# EAGLE design PowerUART (EAGLE 9.0.0)
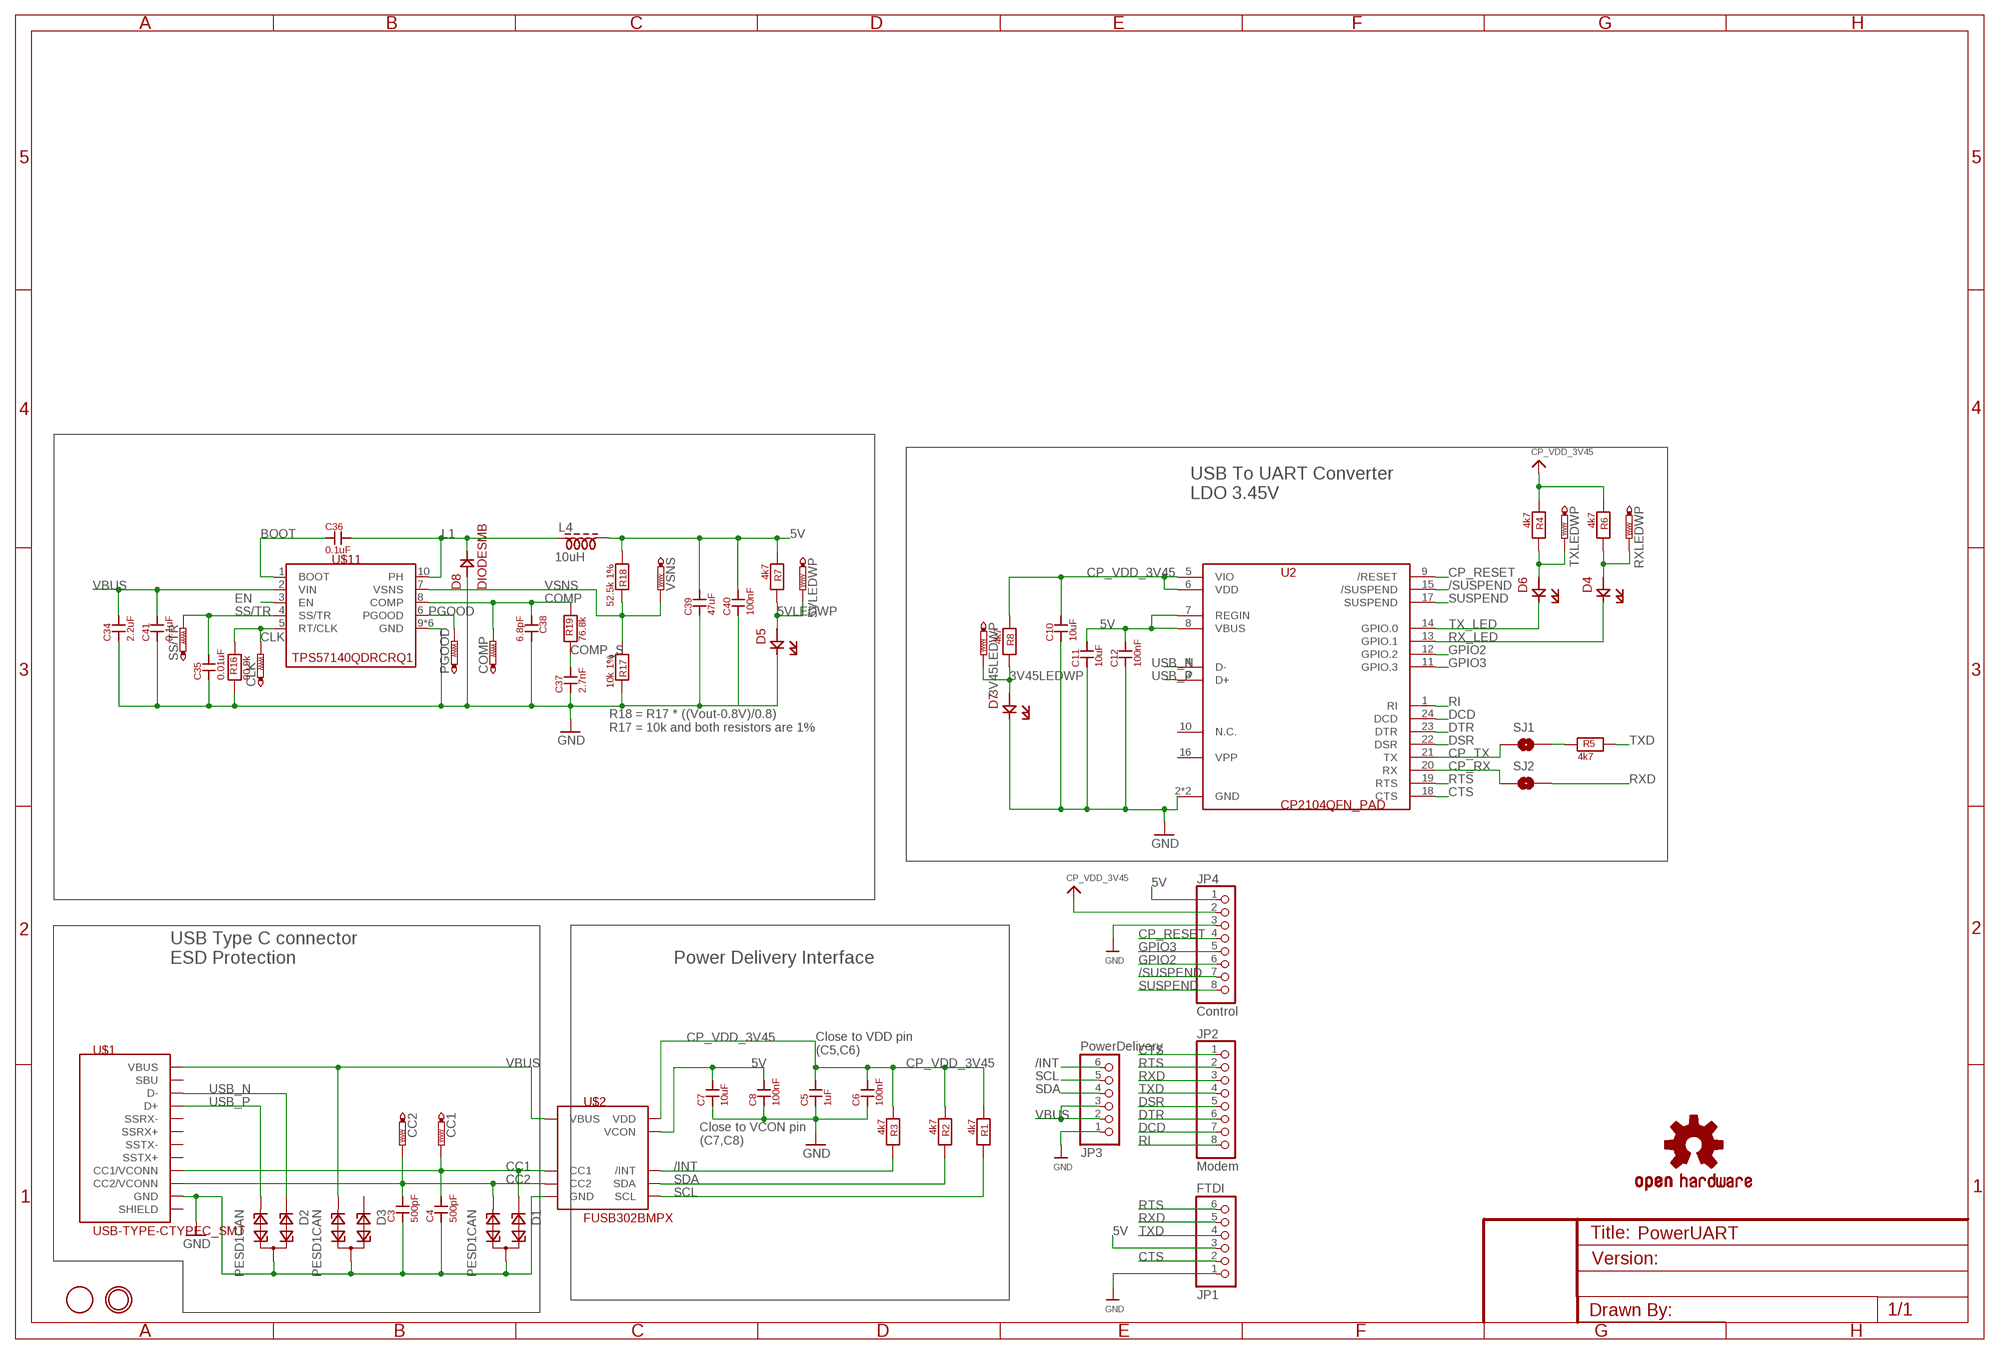
[diagram p0: schematic, sheet 1]

## Parts
3V45LEDWP  CP_RESET  PTR1B1,27  [B1,27]
5VLEDWP  CP_RESET  PTR1B1,27  [B1,27]
C3  500pF  C  [C0402K]
C4  500pF  C  [C0402K]
C5  1uF  C  [C0402K]
C6  100nF  C  [C0402K]
C7  10uF  C  [C0402K]
C8  100nF  C  [C0402K]
C10  10uF  C  [C0402K]
C11  10uF  C  [C0402K]
C12  100nF  C  [C0402K]
C34  2.2uF  C1206  [SM-1206]
C35  0.01uF  C  [C0402K]
C36  0.1uF  C  [C0402K]
C37  2.7nF  C  [C0402K]
C38  6.8pF  C  [C0402K]
C39  47uF  C1206  [SM-1206]
C40  100nF  C  [C0402K]
C41  0.1uF  C  [C0402K]
CC1  CP_RESET  PTR1B1,27  [B1,27]
CC2  CP_RESET  PTR1B1,27  [B1,27]
CLK  CP_RESET  PTR1B1,27  [B1,27]
COMP  CP_RESET  PTR1B1,27  [B1,27]
D1  PESD1CAN  [SOT23]
D2  PESD1CAN  [SOT23]
D3  PESD1CAN  [SOT23]
D4  LED  [CHIP-LED0805]
D5  LED  [CHIP-LED0805]
D6  LED  [CHIP-LED0805]
D7  LED  [CHIP-LED0805]
D8  DIODESMB  [SMBJ]
GND  MOUNTINGHOLE2.0  [MOUNTINGHOLE_2.0_PLATED]
JP1  FTDI  HEADER-1X676MIL  [1X06_ROUND_76]
JP2  Modem  HEADER-1X870MIL  [1X08_ROUND_70]
JP3  PowerDelivery  HEADER-1X676MIL  [1X06_ROUND_76]
JP4  Control  HEADER-1X870MIL  [1X08_ROUND_70]
L4  10uH  INDUCTOR  [DFN600X600X420-2]
LOGO1  OSHW-LOGOMINI  [OSHW-LOGO-MINI]
PGOOD  CP_RESET  PTR1B1,27  [B1,27]
R1  4k7  RESISTOR  [R0402]
R2  4k7  RESISTOR  [R0402]
R3  4k7  RESISTOR  [R0402]
R4  4k7  RESISTOR  [R0402]
R5  4k7  RESISTOR  [R0402]
R6  4k7  RESISTOR  [R0402]
R7  4k7  RESISTOR  [R0402]
R8  4k7  RESISTOR  [R0402]
R16  90.9k  RESISTOR  [R0402]
R17  10k 1%  RESISTOR  [R0402]
R18  52.5k 1%  RESISTOR  [R0402]
R19  76.8k  RESISTOR  [R0402]
RXLEDWP  CP_RESET  PTR1B1,27  [B1,27]
SJ1  SOLDERJUMPER-OLDTRACE  [SJ_2S-TRACE]
SJ2  SOLDERJUMPER-OLDTRACE  [SJ_2S-TRACE]
SS/TR  CP_RESET  PTR1B1,27  [B1,27]
TP2  FIDUCIAL  [FIDUCIAL_1MM]
TXLEDWP  CP_RESET  PTR1B1,27  [B1,27]
U2  CP2104QFN_PAD  [QFN50P400X400X80-25T245]
U$1  USB-TYPE-CTYPEC_SMT  [TYPECSMT]
U$2  FUSB302BMPX  [QFN50P250X250X80-15T150]
U$11  TPS57140QDRCRQ1  [VSON10]
VSNS  CP_RESET  PTR1B1,27  [B1,27]

## Nets
3V45LEDWP: 3V45LEDWP.TP D7.A(_) R8.2(__)
5V: C7.2(__) C8.2(__) C11.2(__) C12.2(__) C39.2(__) C40.2(__) JP1.3 JP4.1 L4.2 R7.1(_) R18.1(_) U2.7(REGIN) U2.8(VBUS) U$2.12(VCON) U$2.13(VCON)
5VLEDWP: 5VLEDWP.TP D5.A(_) R7.2(__)
/INT: JP3.6 R3.2(__) U$2.5(/INT)
/SUSPEND: JP4.7 U2.15(/SUSPEND)
BOOT: C36.1(_) U$11.1(BOOT)
CC1: C4.2(__) CC1.TP D1.1 U$1.A5(CC1/VCONN) U$2.10(CC1) U$2.11(CC1)
CC2: C3.2(__) CC2.TP D1.2 U$1.B5(CC2/VCONN) U$2.1(CC2) U$2.14(CC2)
CLK: CLK.TP R16.2(__) U$11.5(RT/CLK)
COMP: C38.1(_) COMP.TP R19.2(__) U$11.8(COMP)
COMP_S: C37.2(__) R19.1(_)
CP_RESET: JP4.4 U2.9(/RESET)
CP_RX: SJ2.1 U2.20(RX)
CP_TX: SJ1.1 U2.21(TX)
CP_VDD_3V45: C5.2(__) C6.2(__) C10.2(__) JP4.2 R1.1(_) R2.1(_) R3.1(_) R4.1(_) R6.1(_) R8.1(_) U2.5(VIO) U2.6(VDD) U$2.3(VDD) U$2.4(VDD)
CTS: JP1.2 JP2.1 U2.18(CTS)
DCD: JP2.7 U2.24(DCD)
DSR: JP2.5 U2.22(DSR)
DTR: JP2.6 U2.23(DTR)
EN: U$11.3(EN)
GND: C3.1(_) C4.1(_) C5.1(_) C6.1(_) C7.1(_) C8.1(_) C10.1(_) C11.1(_) C12.1(_) C34.1(_) C35.1(_) C37.1(_) C38.2(__) C39.1(_) C40.1(_) C41.1(_) D1.3 D2.3 D3.3 D5.C(__) D7.C(__) D8.A JP1.1 JP3.1 JP4.3 R16.1(_) R17.2(__) U2.2(GND) U2.25(GND) U$1.A1(GND) U$1.A12(GND) U$1.B1(GND) U$1.B12(GND) U$2.8(GND) U$2.9(GND) U$2.15(GND) U$11.9(GND) U$11.11(GND) U$11.12(GND) U$11.13(GND) U$11.14(GND) U$11.15(GND)
GPIO2: JP4.6 U2.12(GPIO.2)
GPIO3: JP4.5 U2.11(GPIO.3)
L1: C36.2(__) D8.C L4.1 U$11.10(PH)
N$1: R5.1(_) SJ1.2
PGOOD: PGOOD.TP U$11.6(PGOOD)
RI: JP2.8 U2.1(RI)
RTS: JP1.6 JP2.2 U2.19(RTS)
RX_LED: D4.C(__) U2.13(GPIO.1)
RXD: JP1.5 JP2.3 SJ2.2
RXLEDWP: D4.A(_) R6.2(__) RXLEDWP.TP
SCL: JP3.5 R1.2(__) U$2.6(SCL)
SDA: JP3.4 R2.2(__) U$2.7(SDA)
SS/TR: C35.2(__) SS/TR.TP U$11.4(SS/TR)
SUSPEND: JP4.8 U2.17(SUSPEND)
TX_LED: D6.C(__) U2.14(GPIO.0)
TXD: JP1.4 JP2.4 R5.2(__)
TXLEDWP: D6.A(_) R4.2(__) TXLEDWP.TP
USB_N: D2.1 U2.4(D-) U$1.A7(D-) U$1.B7(D-)
USB_P: D2.2 U2.3(D+) U$1.A6(D+) U$1.B6(D+)
VBUS: C34.2(__) C41.2(__) D3.2 JP3.2 JP3.3 U$1.A4(VBUS) U$1.A9(VBUS) U$1.B4(VBUS) U$1.B9(VBUS) U$2.2(VBUS) U$11.2(VIN)
VSNS: R17.1(_) R18.2(__) U$11.7(VSNS) VSNS.TP
Unconnected: D3.1 U2.10(N.C.) U2.16(VPP) U$1.A2(SSTX+) U$1.A3(SSTX-) U$1.A8(SBU) U$1.A10(SSRX-) U$1.A11(SSRX+) U$1.B2(SSTX+) U$1.B3(SSTX-) U$1.B8(SBU) U$1.B10(SSRX-) U$1.B11(SSRX+) U$1.SH1(SHIELD) U$1.SH2(SHIELD) U$1.SH3(SHIELD) U$1.SH4(SHIELD)

## Notes on the sheet
- USB To UART Converter
  LDO 3.45V
- R18 = R17 * ((Vout-0.8V)/0.8)
  R17 = 10k and both resistors are 1%
- USB Type C connector
  ESD Protection
- Power Delivery Interface
- Close to VDD pin
  (C5,C6)
- Close to VCON pin
  (C7,C8)

## Library data of the parts
3V45LEDWP 5VLEDWP CC1 CC2 CLK COMP PGOOD RXLEDWP SS/TR TXLEDWP VSNS = testpad:PTR1: TEST PIN
C3-C8 C10-C12 C34-C41 = capacitor:C
D1-D3 = diode:PESD1CAN: CAN bus ESD protection diode Source: http://www.nxp.com/documents/data_sheet/PESD1CAN.pdf
D4-D7 = LED:LED
D8 = Diode:DIODE
GND = microbuilder:MOUNTINGHOLE: Mounting Hole For #2 screws (0.086"/2.18mm width, 0.094"/2.4mm hole) use 2.5mm; BOM: EXCLUDE
JP1 JP3 = microbuilder:HEADER-1X6: PIN HEADER
JP2 JP4 = microbuilder:HEADER-1X8: PIN HEADER
L4 = Inductor:INDUCTOR
LOGO1 = IO_expander:OSHW-LOGO: Open Source Hardware Logo This logo indicates the piece of hardware it is found on incorporates a OSHW license and/or adheres to the definition of open source hardware found here: http://freedomdefined.org/OSHW
R1-R8 R16-R19 = resistor:RESISTOR
SJ1 SJ2 = SparkFun-Retired:SOLDERJUMPER-OLD: Solder Jumper Standard SMD solder jumper. Used to automate production. Two varients : Normally Open and Normally Closed are the same, but have different paste layers. NC will have a large amount of paste and should jumper during reflow.
TP2 = adafruit:FIDUCIAL: For use by pick and place machines to calibrate the vision/machine, 1mm By microbuilder.eu
U2 = CP2104:CP2104
U$1 = lio:USB-TYPE-C
U$2 = PDController:FUSB302BMPX
U$11 = PMIC:TPS57140QDRCRQ1

## Board
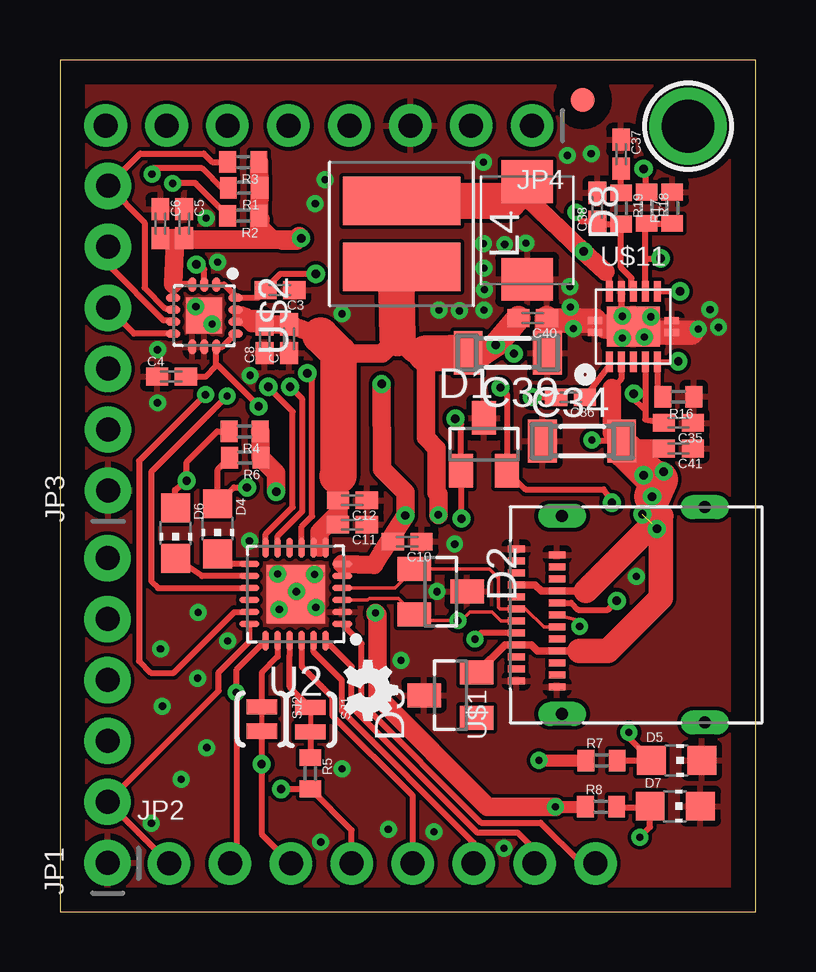
[diagram p1: board, top side]
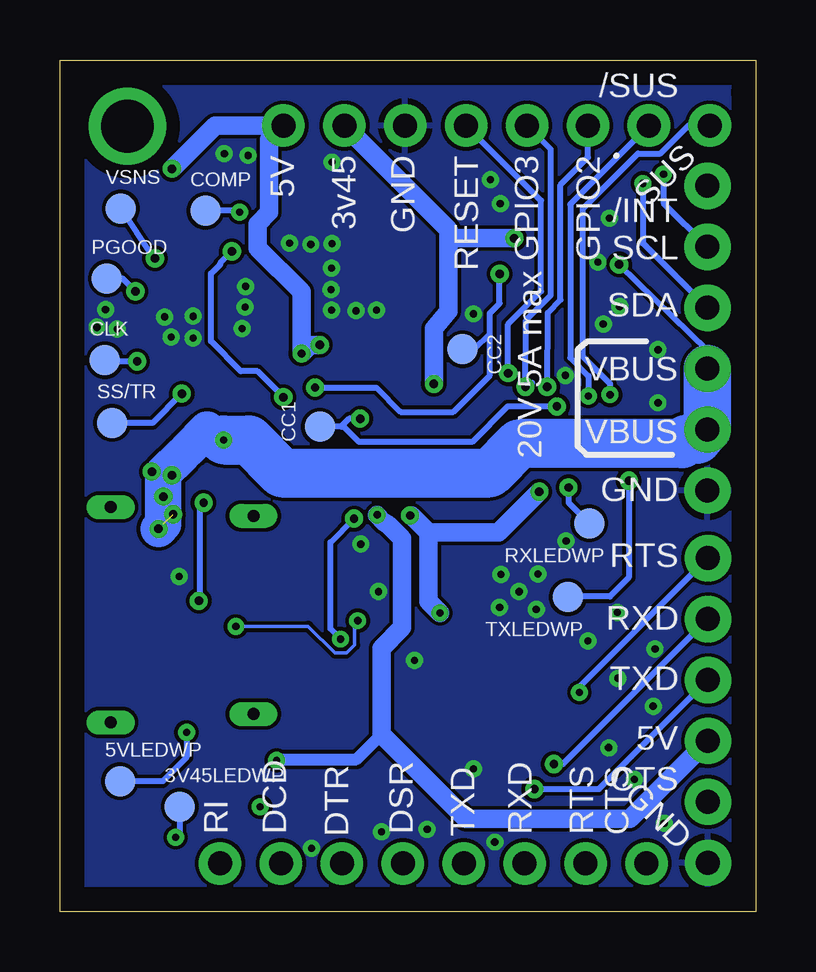
[diagram p2: board, bottom side, seen from below]

Size 29 x 35.5 mm. Coordinates in mm from the lower left corner, seen from the top.
Outline: 1.36,35.5 1.37,35.5
Outline: 0,0 1.19,0 29,0 29,35.5 0,35.5 0,34.14 0,1.19 0,0
Copper layers (1*16): Top 0.035mm / dielectric 1.5mm / Bottom 0.035mm
Design rules "default *": minimum track width 6mil, minimum drill 0.3mm, track to track 6mil, track to pad 6mil, pad to pad 6mil, via to via 6mil, smd to smd 6mil, copper to edge 40mil, drill to drill 6mil, minimum pad ring 10mil, minimum via ring 8mil, stop-mask expansion 4mil, vias tented up to drill 0mil, thermal gap 10mil

### Footprints (pad centres in the part's own frame; a part is rotated, then mirrored left to right if it is on the bottom)
B1,27 = smd 1.27 x 1.27: TP 0,0
C0402K = smd 0.925 x 0.74: 1 -0.6,0; 2 0.6,0
SM-1206 = smd 1.2 x 1.8: 1 -1.65,0; 2 1.65,0
SOT23 = smd 1 x 1.4: 1 -0.95,-1.1; 2 0.95,-1.1; 3 0,1.1
CHIP-LED0805 = smd 1.2 x 1.2: A 0,-1.05; C 0,1.05
SMBJ = smd 1.78 x 2.16: A 2.04,0; C -2.03,0
MOUNTINGHOLE_2.0_PLATED = drill 2.2 pad 3: P$1 0,0
1X06_ROUND_76 = drill 1 pad 1.93: 1 -6.35,0; 2 -3.81,0; 3 -1.27,0; 4 1.27,0; 5 3.81,0; 6 6.35,0
1X08_ROUND_70 = drill 1 pad 1.778: 1 -8.89,0; 2 -6.35,0; 3 -3.81,0; 4 -1.27,0; 5 1.27,0; 6 3.81,0; 7 6.35,0; 8 8.89,0
DFN600X600X420-2 = smd 2.012 x 4.912: 1 -1.375,0; 2 1.375,0
R0402 = smd 0.7 x 0.9: 1 -0.65,0; 2 0.65,0
SJ_2S-TRACE = smd 0.635 x 1.27: 1 -0.508,0; 2 0.508,0
FIDUCIAL_1MM = smd 1 x 1: 1 0,0
QFN50P400X400X80-25T245 = smd 0.837 x 0.264: 1 -1.937,1.25; 2 -1.937,0.75; 3 -1.937,0.25; 4 -1.937,-0.25; 5 -1.937,-0.75; 6 -1.937,-1.25; 13 1.937,-1.25; 14 1.937,-0.75; 15 1.937,-0.25; 16 1.937,0.25; 17 1.937,0.75; 18 1.937,1.25 | smd 0.264 x 0.837: 7 -1.25,-1.937; 8 -0.75,-1.937; 9 -0.25,-1.937; 10 0.25,-1.937; 11 0.75,-1.937; 12 1.25,-1.937; 19 1.25,1.937; 20 0.75,1.937; 21 0.25,1.937; 22 -0.25,1.937; 23 -0.75,1.937; 24 -1.25,1.937 | smd 2.45 x 2.45: 25 0,0
TYPECSMT = smd 0.3 x 0.7: A1 -2.75,5.74; A2 -2.25,5.74; A3 -1.75,5.74; A4 -1.25,5.74; A5 -0.75,5.74; A6 -0.25,5.74; A7 0.25,5.74; A8 0.75,5.74; A9 1.25,5.74; A10 1.75,5.74; A11 2.25,5.74; A12 2.75,5.74; B1 2.5,4.04; B2 2,4.04; B3 1.5,4.04; B4 1,4.04; B5 0.5,4.04; B6 0,4.04; B7 -0.5,4.04; B8 -1,4.04; B9 -1.5,4.04; B10 -2,4.04; B11 -2.5,4.04; B12 -3,4.04 | drill 0.5 pad 0.8 long: SH1 -4.13,3.83; SH2 -4.49,-2.12; SH3 4.49,-2.12; SH4 4.13,3.83
QFN50P250X250X80-15T150 = smd 0.612 x 0.332: 1 -1.3,0.5; 2 -1.3,0; 3 -1.3,-0.5; 8 1.3,-0.5; 9 1.3,0; 10 1.3,0.5 | smd 0.332 x 0.612: 4 -0.75,-1.3; 5 -0.25,-1.3; 6 0.25,-1.3; 7 0.75,-1.3; 11 0.75,1.3; 12 0.25,1.3; 13 -0.25,1.3; 14 -0.75,1.3 | smd 1.5 x 1.5: 15 0,0
VSON10 = smd 0.3 x 0.85: 1 -1,-1.475; 2 -0.5,-1.475; 3 0,-1.475; 4 0.5,-1.475; 5 1,-1.475; 6 1,1.475; 7 0.5,1.475; 8 0,1.475; 9 -0.5,1.475; 10 -1,1.475 | smd 2.2 x 1.65: 11 0,0 | smd 0.6 x 0.28: 12 1.6,-0.25; 13 1.6,0.25; 14 -1.6,0.25; 15 -1.6,-0.25

### Placement (x,y rotation side)
3V45LEDWP  24,4.37 0 bottom
5VLEDWP  26.49,5.44 0 bottom
C3  9.17,25.91 180 top
C4  4.65,22.3 0 top
C5  5.18,28.68 270 top
C6  4.19,28.68 270 top
C7  9.55,23.88 90 top
C8  8.53,23.88 90 top
C10  14.48,15.42 180 top
C11  12.19,16.13 180 top
C12  12.19,17.14 180 top
C34  21.77,19.61 0 top
C35  25.78,20.37 180 top
C36  21.29,21.44 180 top
C37  23.39,31.57 270 top
C38  22.4,29.36 90 top
C39  18.67,23.29 180 top
C40  19.71,24.74 180 top
C41  25.78,19.3 180 top
CC1  18.16,20.22 90 bottom
CC2  12.22,23.44 270 bottom
CLK  27.13,22.99 0 bottom
COMP  22.94,29.21 0 bottom
D1  17.68,19.48 0 top
D2  15.88,13.34 270 top
D3  16.28,9.02 90 top
D4  6.58,15.95 180 top
D5  25.7,6.3 270 top
D6  4.83,15.77 180 top
D7  25.65,4.39 270 top
D8  19.48,28.4 270 top
GND  26.19,32.74 0 top
JP1  1.98,8.38 90 top
JP2  13.44,2.01 0 top
JP3  2.01,23.9 90 top
JP4  10.79,32.77 180 top
L4  14.25,28.24 270 top
LOGO1  12.85,9.22 270 top
PGOOD  27.05,26.39 0 bottom
R1  7.67,30.18 180 top
R2  7.65,29.01 180 top
R3  7.65,31.24 180 top
R4  7.7,20.02 180 top
R5  10.44,5.77 270 top
R6  7.72,18.92 180 top
R7  22.58,6.3 0 top
R8  22.56,4.37 0 top
R16  25.78,21.46 180 top
R17  25.53,29.34 90 top
R18  24.46,29.34 270 top
R19  23.39,29.31 270 top
RXLEDWP  6.93,16.18 180 bottom
SJ1  10.44,8 270 top
SJ2  8.41,8.03 270 top
SS/TR  26.82,20.37 0 bottom
TP2  21.79,33.83 0 top
TXLEDWP  7.82,13.11 180 bottom
U2  9.83,13.23 180 top
U$1  24.77,12.37 90 top
U$2  6.02,24.84 270 top
U$11  23.9,24.38 0 top
VSNS  26.47,29.31 0 bottom

### Tracks (layer width: path | path; a pad name or v marks a point on that pad's centre or on a via)
3V45LEDWP  (via drill 0.3)
  Top 0.254: v24.18,3.1 24.6,3.52 24.6,4.34 | 24.6,4.34 D7.A | R8.2 23.23,4.34 24.6,4.34
  Bottom 0.254: 3V45LEDWP.TP 24,3.28 v24.18,3.1
5V  (via drill 0.3, 0.35)
  Top 0.254: U$2.12 7.55,24.59 7.8,24.84 7.57,24.84 U$2.13 | R18.1 24.43,30.01 24.43,30.86 v24.33,30.96 | U2.8 10.82,15.17 U2.7 | C12.2 11.61,17.16 11.61,18.19
  Top 0.508: 9.5,24.53 C8.2 8.45,24.84 7.8,24.84 | 9.5,24.53 C7.2 | 9.51,24.54 9.5,24.53 | 11.61,18.19 11.61,16.78 11.62,17.02 | v19.96,6.3 R7.1
  Top 0.762: 10.87,24 10.86,23.99 C7.2 C8.2 8.01,24.53 7.75,24.79 7.62,24.79 7.57,24.84 | C11.2 11.62,16.61 | 11.62,16.61 11.62,17.02 C12.2 | 11.62,16.61 10.82,15.81 10.82,15.17 | v15.77,16.54 15.77,17.38 15.7,17.46 15.7,19.31 15.26,19.75 15.26,23.26 15.27,23.27 | 11.61,23.27 13.44,23.27 14.07,23.9 14.69,23.28 16.3,23.28
  Top 1.016: C40.2 v18.17,23.62 17.64,23.27 C39.2
  Top 1.524: C39.2 16.3,23.28 15.27,23.27 | 10.87,24 11.61,23.27 11.61,18.19 11.58,18.16 | L4.2 14.02,26.82 14.07,23.9
  Bottom 0.254: 20.57,27.85 20.76,27.67
  Bottom 0.508: 15.6,9.4 15.6,10.97 | v19.96,6.3 19.91,6.35 16.64,6.35 15.6,7.39 | JP4.1 20.4,32.05 20.4,31.21
  Bottom 0.762: v24.33,30.96 22.53,32.77 JP4.1 20.27,32.18 20.27,29.15 20.76,28.66 20.76,27.67 18.93,25.84 v18.93,23.26 18.57,23.62 v18.17,23.62 | JP1.3 5.23,3.86 12.06,3.86 15.6,7.39 15.6,10.97 14.73,11.84 14.73,15.55 15.31,16.13 15.52,16.23 v15.77,16.54
5VLEDWP  (via drill 0.3)
  Top 0.254: R7.2 D5.A 23.72,7.23 v23.72,7.47
  Bottom 0.254: v23.72,7.47 23.72,6.43 24.71,5.44 5VLEDWP.TP
/INT
  Top 0.254: U$2.5 4.67,25.15 4.39,25.15 3.53,26.01 3.53,28.73 JP3.6 3.35,31.6 5.99,31.6 6.35,31.24 R3.2 6.91,31.19
/SUSPEND  (via drill 0.3)
  Top 0.254: v6.96,21.49 3.81,18.33 3.81,13.76 4.09,13.48 U2.15
  Bottom 0.254: JP4.7 7.72,29.49 7.72,23.09 6.96,22.33 v6.96,21.49
BOOT
  Top 0.254: C36.1 22.9,22.76 U$11.1
CC1  (via drill 0.3, 0.35)
  Top 0.254: U$2.11 6.77,23.54 U$2.10 6.52,22.75 | C4.2 6.07,22.3 6.52,22.75 | 6.52,22.75 6.6,22.75 v8.28,21.07 v8.28,21.06 | U$1.A5 17.56,11.62 v17.3,11.35 | v16.74,16.38 D1.1 16.73,20.3 v16.48,20.55
  Bottom 0.254: v16.74,16.38 17.73,15.39 17.73,11.78 v17.3,11.35 | v8.28,21.06 10.34,21.06 11.81,19.58 16.54,19.58 17.17,20.22 17.27,20.22 | 17.27,20.22 CC1.TP | v16.48,20.55 16.94,20.55 17.27,20.22
CC2  (via drill 0.35)
  Top 0.254: U$2.14 7.39,25.59 | 7.39,25.59 8.25,25.59 C3.2 8.62,26.02 9.19,26.58 v10.67,26.58 | U$2.1 6.84,26.14 7.39,25.59 | U$1.B5 21.32,12.87 21.6,12.58 22.84,12.58 v23.22,12.95 | v23.01,17.04 22.66,17.6 19.41,17.6 D1.2 18.63,21.58 v18.36,21.84
  Bottom 0.254: 11.07,24.08 11.07,22.35 12.6,20.83 14.79,20.83 15.81,21.84 v18.36,21.84 | 11.07,24.08 11.07,24.94 10.67,25.35 v10.67,26.58 | v23.22,12.95 23.16,13.01 23.16,17.09 v23.01,17.04 | CC2.TP 11.71,23.44 11.07,24.08
CLK  (via drill 0.35)
  Top 0.254: R16.2 24.9,21.69 U$11.5 25.55,22.91 25.76,22.91 v25.78,22.94
  Bottom 0.254: v25.78,22.94 27.08,22.94 CLK.TP
COMP  (via drill 0.3)
  Top 0.254: U$11.8 23.83,25.93 23.83,26.4 23.39,26.84 R19.2 22.5,28.66 C38.1 21.76,28.76 v21.51,29.16
  Bottom 0.254: v21.51,29.16 21.67,29.21 COMP.TP
COMP_S
  Top 0.254: R19.1 C37.2
CP_RESET  (via drill 0.35)
  Top 0.254: U2.9 10.08,16.05 10.52,16.48 10.52,22.22 v10.31,22.44
  Bottom 0.254: v10.31,22.44 10.31,24.48 8.94,25.86 8.94,29.64 JP4.4
CP_RX
  Top 0.254: U2.20 9.08,10.63 8.41,9.96 8.41,9.42 8.41,8.79 SJ2.1
CP_TX
  Top 0.254: U2.21 9.58,10.69 9.58,9.37 SJ1.1
CP_VDD_3V45  (via drill 0.3, 0.35)
  Top 0.152: C10.2 12.94,14.48 U2.6
  Top 0.254: U$2.4 4.72,26.16 | 4.72,26.16 | U$2.3 5.5,26.16 4.72,26.16 | U2.5 U2.6
  Top 0.508: v20.65,4.37 R8.1
  Top 0.762: C6.2 4.75,28.08 | 4.75,28.08 C5.2 | 5.23,28.18 C5.2 | 4.72,26.16 4.8,28.03 4.75,28.08 | U2.6 13.09,14.46 13.43,14.99 v14.4,16.51 14.4,17.48 13.44,18.44 v13.41,22 | 10.01,28.12 9.97,28.15 9.83,28.01 8.84,28.01 | 10.01,28.12 v10.06,28.07 | R4.1 8.37,19.99 R6.1 9.02,18.28 v9.02,17.5 | C5.2 5.4,28.01 8.46,28.01 | 9.27,27.98 9.87,27.98 10.01,28.12 | R2.1 8.36,28.84 | 8.46,28.01 8.84,28.01 | R2.1 R1.1 R3.1 | R2.1 8.29,28.18 8.46,28.01 | R2.1 8.29,28.56 8.84,28.01 | v20.65,4.37 17.83,4.37 13.23,8.97 13.23,12.37 | 13.23,12.37 13.19,12.37 13.16,12.41 | v13.16,12.45 13.23,12.37
  Bottom 0.254: v14.4,16.51
  Bottom 0.762: v9.02,17.5 10.72,15.8 13.64,15.8 | 12.8,28.19 12.8,25.04 13.41,24.31 v13.41,22 | 12.8,28.19 12.8,28.42 JP4.2 | v10.06,28.07 12.67,28.07 12.8,28.19 | v14.4,16.51 14.35,16.51 13.64,15.8 | v13.16,12.45 13.64,12.93 13.64,15.8
CTS
  Top 0.254: U2.18 7.89,11.25 6.62,9.97 6.62,9.21 JP1.2 JP2.1
DCD
  Top 0.254: JP2.7 19.79,2.59 19.08,3.3 17.39,3.3 12.17,8.52 12.17,10.21 U2.24
DSR
  Top 0.254: JP2.5 14.71,4.83 11.35,8.19 11.35,8.94 10.08,10.22 U2.22
DTR
  Top 0.254: JP2.6 17.25,2.87 11.76,8.36 11.76,9.64 10.58,10.82 U2.23
GND  (via drill 0.3)
  Top 0.254: U$11.9 23.4,25.05 v23.44,24.82
  Top 1.016: 22.73,24.38 U$11.11 24.15,24.13 U$11.12 26.31,24.13 | C39.1 20.31,23.27 C40.1 20.42,24.63 U$11.14
  other vias: 24.64,24.79 24.36,23.95 23.44,23.9 6.35,24.49 5.66,25.22 7.92,22.35 6.1,28.91 11.76,24.92 15.72,13.34 4.19,10.95 4.06,23.42 6.58,27.08 14.22,10.46 9.14,12.6 9.07,14.07 10.62,14.05 10.67,12.67 16.46,15.32 6.12,6.83 5.05,5.51 3.81,3.68 4.27,8.56 5.74,9.73 6.99,11.28 21.41,24.31 21.29,25.2 18.54,27.81 17.65,27.84 17.68,26.82 17.7,25.93 17.68,25.07 16.66,25.04 15.8,25.07 26.62,24.28 27.1,25.1 27.46,24.36 13.69,3.43 15.6,3.33 11.76,5.94 10.87,2.9 7.9,15.44 4.06,21.21 10.64,29.51 11.05,30.51 17.65,31.24 21.16,31.52 22.15,31.6 18.52,2.64 24.03,13.97 21.26,26.06 19.43,27.86 5.77,12.47 9.86,13.34
  pour Bottom (isolate 0.152): 0.25,35.2 0.25,0.33 28.63,0.33 28.63,35.2
  pour Top (isolate 0.152): 0.25,35.2 0.25,0.33 28.35,0.3 28.35,35.18
GPIO2  (via drill 0.35)
  Top 0.254: U2.12 8.58,15.73 9.7,16.86 9.7,20.84 8.94,21.6 8.94,21.62 v8.69,21.88
  Bottom 0.254: v8.69,21.88 8.66,24.97 8.13,25.5 8.13,30.3 6.99,31.45 JP4.6
GPIO3  (via drill 0.35)
  Top 0.254: U2.11 9.08,15.66 10.11,16.69 10.11,21.36 v9.6,21.88
  Bottom 0.254: 9.32,22.05 9.4,22.05 v9.6,21.88 9.57,24.66 8.53,25.69 8.53,31.77 JP4.5
L1  (via drill 0.35)
  Top 0.254: U$11.10 22.9,26.32 22.73,26.67 | C36.2 19.73,21.44 v19.68,21.45
  Top 0.762: 22.73,26.67 v21.83,27.52 19.48,29.74 D8.C
  Top 1.524: L4.1 18.7,29.64 D8.C
  Bottom 0.254: v19.68,21.45 20.77,22.53 21.46,22.53 22.7,23.77 22.7,26.6 22.32,26.98 22.32,27.03 v21.83,27.52
N$1
  Top 0.254: SJ1.2 R5.1
PGOOD  (via drill 0.35)
  Top 0.254: U$11.6 v25.86,25.86
  Bottom 0.254: PGOOD.TP 26.39,26.39 v25.86,25.86
RI
  Top 0.254: JP2.8 21.74,2.01 20.04,3.71 17.56,3.71 12.57,8.69 12.57,11.18 U2.1
RTS  (via drill 0.3)
  Top 0.254: U2.19 7.37,10.09 7.37,9.16 | JP2.2 7.37,2.29 7.37,9.16 | v7.34,9.14 7.37,9.16
  Bottom 0.254: v7.34,9.14 7.34,9.37 JP1.6
RX_LED
  Top 0.254: U2.13 6.92,14.48 D4.C
RXD  (via drill 0.35)
  Top 0.254: SJ2.2 v8.41,6.15 8.41,3.23 JP2.3
  Bottom 0.254: JP1.5 8.03,6.15 v8.41,6.15
RXLEDWP  (via drill 0.35)
  Top 0.254: R6.2 6.58,18.43 D4.A 7.26,17.68 v7.8,17.68
  Bottom 0.254: v7.8,17.68 7.8,17.04 RXLEDWP.TP
SCL  (via drill 0.3)
  Top 0.254: U$2.6 4.67,24.65 4.32,24.65 2.01,26.96 JP3.5 | R1.2 6.81,30.1 5.92,30.99 3.86,30.99 v3.83,30.74
  Bottom 0.254: v3.83,30.74 3.83,29.54 JP3.5
SDA  (via drill 0.3)
  Top 0.254: U$2.7 3.09,24.09 JP3.4 | v4.7,30.36 5.67,30.36 5.67,30.33 R2.2
  Bottom 0.254: v4.7,30.36 4.7,27.86 JP3.4
SS/TR  (via drill 0.35)
  Top 0.254: U$11.4 24.4,20.9 | 24.4,20.9 24.4,20.52 C35.2 | 24.4,20.9 23.85,21.45 23.85,21.46 23.92,21.54 v23.92,21.59
  Bottom 0.254: v23.92,21.59 25.14,20.37 SS/TR.TP
SUSPEND  (via drill 0.3)
  Top 0.254: v6.06,21.55 3.3,18.78 3.3,10.44 3.79,9.96 4.75,9.96 7.28,12.48 U2.17
  Bottom 0.254: JP4.8 2.79,32.77 3.96,31.6 4.9,31.6 7.21,29.29 7.21,23.16 6.06,22.01 v6.06,21.55
TX_LED
  Top 0.254: U2.14 5.92,13.98 D6.C
TXD  (via drill 0.35)
  Top 0.254: JP2.4 12.17,3.39 R5.2 v9.23,5.12 v9.22,5.11
  Bottom 0.254: 9.09,4.95 v9.22,5.11 6.53,5.11 JP1.4
TXLEDWP  (via drill 0.35)
  Top 0.254: D6.A 4.8,17.58 v5.28,17.96 5.28,18.75 6.55,20.02 R4.2
  Bottom 0.254: TXLEDWP.TP 7.72,13.23 7.62,13.13 6.07,13.13 5.28,13.92 v5.28,17.96
USB_N
  Top 0.152: 18.29,13.97 18.29,13.89 | 18.29,13.89 18.29,12.68 18.34,12.62 U$1.A7 | 18.77,12.62 U$1.A7 | U$1.A7 19.41,12.62 20.17,11.86 20.72,11.86 U$1.B7 | 18.29,13.89 17.9,14.29 D2.1 13.97,13.48 U2.4
USB_P  (via drill 0.3)
  Top 0.152: 15.17,12.12 D2.2 | U$1.B6 21.79,12.09 v21.67,11.89 | D2.2 15.36,12.13 v16.59,12.13 16.72,12.13 17.09,12.5 18.01,12.5 18.39,12.12 U$1.A6 | U2.3 12.83,12.98 12.9,13.06 14.1,13.06 D2.2
  Bottom 0.152: v16.59,12.13 16.72,12 16.72,11.11 17.06,10.77 17.54,10.77 18.65,11.89 v21.67,11.89
VBUS  (via drill 0.3, 0.35)  (1 unrouted)
  Top 0.254: U$11.2 23.4,22.21 23.01,21.82 | U$2.2 6.02,26.77 v5.69,26.98 | v24.33,18.19 24.5,18.02 25.01,18.02 25.01,18.18 v25.17,18.34 | 25.04,16.48 24.69,16.13 | C34.2 22.48,19.61 v22.18,19.66
  Top 0.305: U$1.A9 19.81,13.62 20.07,13.36 20.72,13.36 U$1.B4 21.93,13.37 21.95,13.39 | D3.2 18.56,11.12 U$1.A4 19.66,11.12 19.91,10.87 U$1.B9 21.66,10.87
  Top 0.762: 23.01,21.82 23.01,19.96 C34.2 23.67,19.3 C41.2
  Top 1.016: 25.07,16.48 25.04,16.48 25.04,13.08 22.84,10.87 21.66,10.87 | 21.93,13.37 24.69,16.13 v24.69,17.3
  Top 1.524: v24.69,17.3 25.01,18.02 24.77,18.02 23.58,19.21
  Bottom 0.254: v5.69,26.98 2.01,23.39 JP3.3 | 23.69,19.27 23.91,19.04 24.61,18.34 | 24.61,18.34 v25.17,18.34 | 24.61,18.34 24.69,18.26 | 22.86,20.09 v22.18,19.66
  Bottom 1.524: 22.86,20.09 23.69,19.27 | 23.91,19.04 24.69,18.26 v24.69,17.3 24.69,16.15 v24.89,15.95
  Bottom 1.981: JP3.3 JP3.2 2.41,19.68
  Bottom 2.032: v22.18,19.66 21.12,19.66 19.75,18.29 11.07,18.29 9.86,19.51 3.07,19.51 2.89,19.68 2.41,19.68
  other vias: 24.28,16.56
VSNS  (via drill 0.35)
  Top 0.254: U$11.7 24.4,27.23 | 24.4,27.23 24.4,28.63 R18.2 R17.1 | 24.4,27.23 v25.04,27.23
  Bottom 0.254: VSNS.TP 25.15,27.33 v25.04,27.23

### Text on the board
bNames: /SUS | SUS | GPIO2 | GPIO3 | RESET | GND | 3v45 | 5V | /INT | SCL | SDA | VBUS | VBUS | 20V 5A max | GND | RTS | RXD | TXD | 5V | CTS | GND | CTS | RTS | RXD | TXD | DSR | DTR | DCD | RI
bTest: Engineerd by / @bindebende / REV A / 2018.11.24. / github.com/ / bindebende/PowerUART